# Altium project DC075B.PrjPcb (part 6 of 7)

## Sheet DC075B_DTGC_CPLD.SchDoc: DTGC CPLD
size 558 x 431 mm; Date: Not shown in title block; ApprovedBy: Not shown in title block; CheckedBy: Not shown in title block; Author: Not shown in title block; CompanyName: Not shown in title block; DrawnBy: Praveen Aroul; Engineer: Not shown in title block; Organization: Not shown in title block; Address1: Not shown in title block; Address2: Not shown in title block; Address3: Not shown in title block; Address4: Not shown in title block; DocumentNumber: 9; Revision: Use project parameter SCH_Rev; SheetNumber: 9; SheetTotal: 13; PageSetup: Record=PageOptions|CenterHorizontal=True|CenterVertical=True|PrintScale=1.00|XCorrection=1.00|YCorrection=1.00|PrintKind=0|BorderSize=5000000|LeftOffset=0|BottomOffset=0|Orientation=2|PaperLength=1000|PaperWidth=1000|Scale=100|PaperSource=15|PrintQuality=600|MediaType=1|DitherType=10|PaperKind=Letter|PrintScaleMode=1; CurrentTime: Not shown in title block; CurrentDate: Not shown in title block; Time: Not shown in title block; DocumentFullPathAndName: Not shown in title block; DocumentName: Not shown in title block; ModifiedDate: Not shown in title block; ImagePath: Not shown in title block
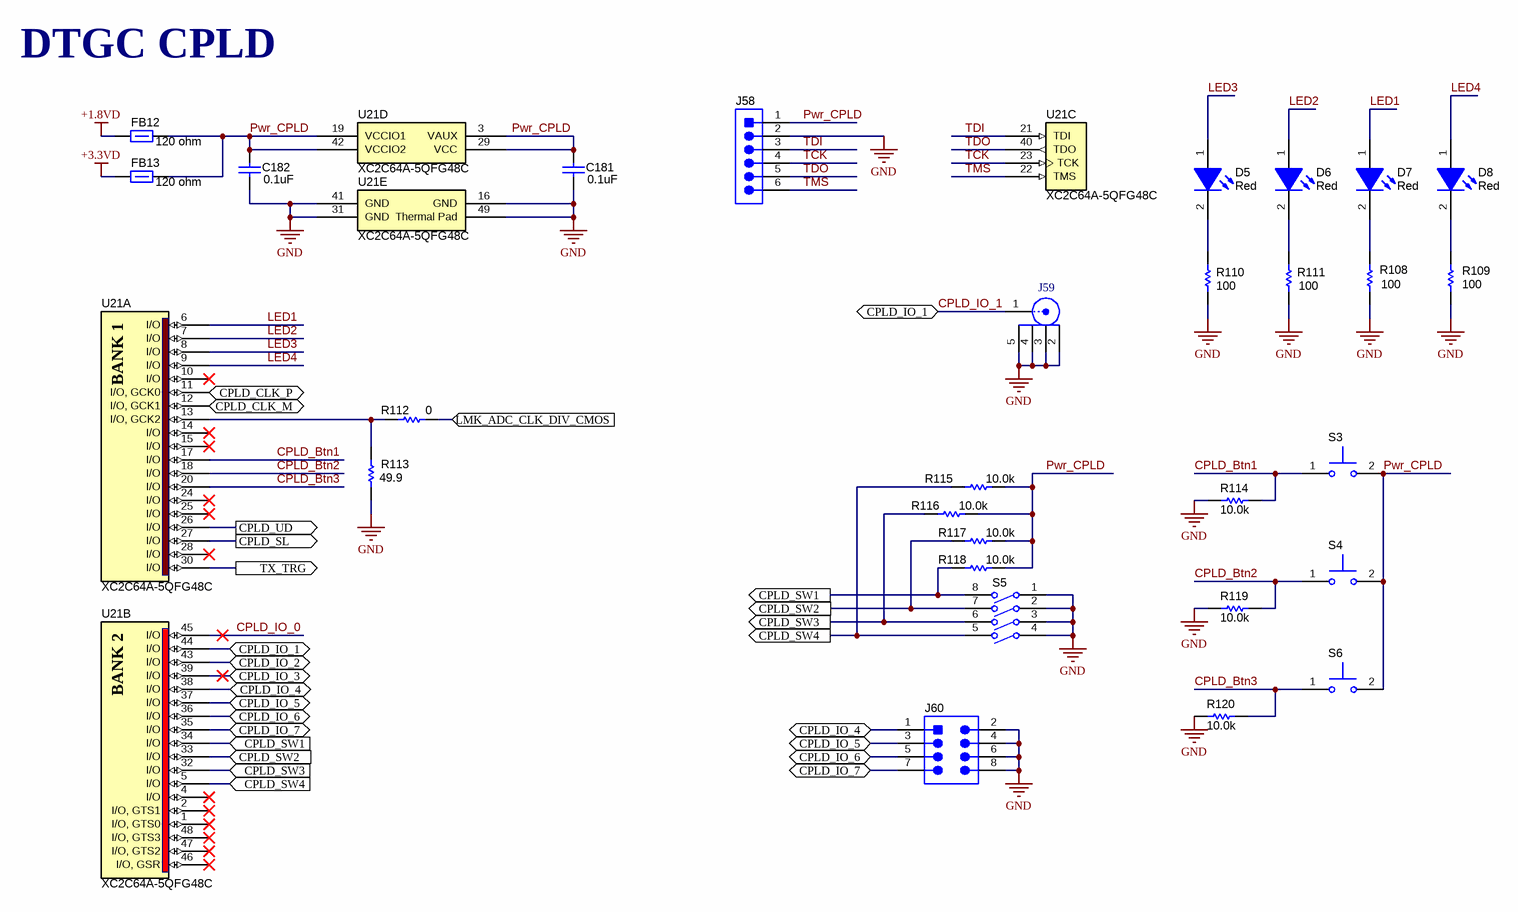
[diagram p24: DC075B_DTGC_CPLD.SchDoc]

### Parts
C181  value 0.1uF  [0603]  (hidden comment: CL10A104KA8NNNC)
C182  value 0.1uF  [0603]  (hidden comment: CL10A104KA8NNNC)
D5  value Red  [LED_LTST-C190_Red]  (hidden comment: LTST-C190CKT)
D6  value Red  [LED_LTST-C190_Red]  (hidden comment: LTST-C190CKT)
D7  value Red  [LED_LTST-C190_Red]  (hidden comment: LTST-C190CKT)
D8  value Red  [LED_LTST-C190_Red]  (hidden comment: LTST-C190CKT)
FB12  value 120 ohm  [0805]  (hidden comment: Ferrite_Bead)
FB13  value 120 ohm  [0805]  (hidden comment: Ferrite_Bead)
J58  Header_6x1  [TSW-106-07-G-S]  (value not drawn)
J59  5-1814832-1  [TE_5-1814832-1]  (value not drawn)
J60  Header_4x2  [TSW-104-07-G-D]  (value not drawn)
R108  ValueDisplayed: 100  [0402]  (hidden comment: Resistor)
R109  ValueDisplayed: 100  [0402]  (hidden comment: Resistor)
R110  ValueDisplayed: 100  [0402]  (hidden comment: Resistor)
R111  ValueDisplayed: 100  [0402]  (hidden comment: Resistor)
R112  value 0  [0402]  (hidden comment: Resistor)
R113  value 49.9  [0402]  (hidden comment: Resistor)
R114  value 10.0k  [0603]  (hidden comment: Resistor)
R115  value 10.0k  [0603]  (hidden comment: Resistor)
R116  value 10.0k  [0603]  (hidden comment: Resistor)
R117  value 10.0k  [0603]  (hidden comment: Resistor)
R118  value 10.0k  [0603]  (hidden comment: Resistor)
R119  value 10.0k  [0603]  (hidden comment: Resistor)
R120  value 10.0k  [0603]  (hidden comment: Resistor)
S3  SKRKAEE020  [SW_SKRKAE]  (value not drawn)
S4  SKRKAEE020  [SW_SKRKAE]  (value not drawn)
S5  SW_4SPST  [SW_1571983-5]  (value not drawn)
S6  SKRKAEE020  [SW_SKRKAE]  (value not drawn)
U21  XC2C64A-5QFG48C  [QFG48_N]  (parts A,B,C,D,E of 5)

### Ports
CPLD_CLK_M (out), CPLD_CLK_P (out), CPLD_IO_1, CPLD_IO_2, CPLD_IO_3, CPLD_IO_4 (bidir), CPLD_IO_5, CPLD_IO_6, CPLD_IO_7, CPLD_SL (out), CPLD_SW1 (in), CPLD_SW1 (out), CPLD_SW2 (in), CPLD_SW2 (out), CPLD_SW3 (in), CPLD_SW3 (out), CPLD_SW4 (in), CPLD_SW4 (out), CPLD_UD (out), LMK_ADC_CLK_DIV_CMOS (in), TX_TRG (out)

### Nets
+1.8VD: FB12.2
+3.3VD: FB13.2
GND: C181.2 C182.2 J58.2 J59.2 J59.3 J59.4 J59.5 J60.2 J60.4 J60.6 J60.8 R108.1 R109.1 R110.1 R111.1 R113.2 R114.2 R119.2 R120.2 S5.1(A1) S5.2(A2) S5.3(A3) S5.4(A4) U21.16(GND) U21.31(GND) U21.41(GND) U21.49(Thermal_Pad)
CPLD_Btn1: R114.1 S3.1 U21.17(I/O)
CPLD_Btn2: R119.1 S4.1 U21.18(I/O)
CPLD_Btn3: R120.1 S6.1 U21.20(I/O)
CPLD_CLK_M: U21.12(I/O,_GCK1) ; port CPLD_CLK_M
CPLD_CLK_P: U21.11(I/O,_GCK0) ; port CPLD_CLK_P
CPLD_IO_0: U21.45(I/O)
CPLD_IO_1: J59.1 U21.44(I/O) ; port CPLD_IO_1
CPLD_IO_2: U21.43(I/O) ; port CPLD_IO_2
CPLD_IO_3: U21.39(I/O) ; port CPLD_IO_3
CPLD_IO_4: J60.1 U21.38(I/O) ; port CPLD_IO_4
CPLD_IO_5: J60.3 U21.37(I/O) ; port CPLD_IO_5
CPLD_IO_6: J60.5 U21.36(I/O) ; port CPLD_IO_6
CPLD_IO_7: J60.7 U21.35(I/O) ; port CPLD_IO_7
CPLD_SL: U21.27(I/O) ; port CPLD_SL
CPLD_SW1: R118.1 S5.8(B1) U21.34(I/O) ; port CPLD_SW1
CPLD_SW2: R117.1 S5.7(B2) U21.33(I/O) ; port CPLD_SW2
CPLD_SW3: R116.1 S5.6(B3) U21.32(I/O) ; port CPLD_SW3
CPLD_SW4: R115.1 S5.5(B4) U21.5(I/O) ; port CPLD_SW4
CPLD_UD: U21.26(I/O) ; port CPLD_UD
LED1: D7.1(A) U21.6(I/O)
LED2: D6.1(A) U21.7(I/O)
LED3: D5.1(A) U21.8(I/O)
LED4: D8.1(A) U21.9(I/O)
LMK_ADC_CLK_DIV_CMOS: R112.1 ; port LMK_ADC_CLK_DIV_CMOS
Pwr_CPLD: C181.1 C182.1 FB12.1 FB13.1 J58.1 R115.2 R116.2 R117.2 R118.2 S3.2 S4.2 S6.2 U21.3(VAUX) U21.19(VCCIO1) U21.29(VCC) U21.42(VCCIO2)
TCK: J58.4 U21.23(TCK)
TDI: J58.3 U21.21(TDI)
TDO: J58.5 U21.40(TDO)
TMS: J58.6 U21.22(TMS)
TX_TRG: U21.30(I/O) ; port TX_TRG
NetD5_2: D5.2(K) R110.2
NetD6_2: D6.2(K) R111.2
NetD7_2: D7.2(K) R108.2
NetD8_2: D8.2(K) R109.2
NetR112_2: R112.2 R113.1 U21.13(I/O,_GCK2)

Not connected (* = marked no-connect by the designer): U21 1(I/O,_GTS0)* 2(I/O,_GTS1)* 4(I/O)* 10(I/O)* 14(I/O)* 15(I/O)* 24(I/O)* 25(I/O)* 28(I/O)* 46(I/O,_GSR)* 47(I/O,_GTS2)* 48(I/O,_GTS3)*

### Notes on the sheet
- DTGC CPLD
- Drawn By:
- SVN Rev:
- Number:
- TID #:
- Orderable:
- Rev:
- Sheet Title:
- File:
- Project Title:
- Designed for:
- Assembly Variant:
- Mod. Date:
- Sheet:
- Size:
- of
- C
- http://www.ti.com
- Texas Instruments and/or its licensors do not warrant the accuracy or completeness of this specification or any information contained therein. Texas Instruments and/or its licensors do not warrant that this design will meet the specifications, will be suitable for your application or fit for any particular purpose, or will operate in an implementation. Texas Instruments and/or its licensors do not warrant that the design is production worthy. You should completely validate and test your design implementation to confirm the system functionality for your application.
- Engineer:
- Contact:
- © Texas Instruments
- (in symbol CMP-0005395-2, part A) BANK 1
- (in symbol CMP-0005395-2, part B) BANK 2

### Library data of the parts
C181 C182 = CMP-0085577-2: CAP, CERM, 0.1 µF, 25 V,+/- 10%, X5R, 0603; Manufacturer: Samsung Electro-Mechanics; Polarized: N; ValueDisplayed: 0.1µF; U/M: EA; Cap_F: 100nF; VDC_V: 25V; TaMin_C: -55°C; TaMax_C: 85°C; AEC Category: Q200; SizeArea_mm2: 1.28; SizeAreaWB_mm2: 4.68; SizeX_mm: 1.6; SizeY_mm: 0.8; SizeZ_mm: 1; Green_REACh: Incomplete; Green_Lifecycle: Active; CompType: Capacitor; PartNumber: CL10A104KA8NNNC; PackageReference: 0603; RoHS: Y; Tolerance_%: 10%; Value2: 25V; MountType: SMT; Technology: Ceramic; TempCo: X5R; Cap_Case: 0603; ComponentLink1Description: Datasheet link; ComponentLink1URL: http://www.samsungsem.com/kr/support/product-search/mlcc/__icsFiles/afieldfile/2018/06/20/CL10A104KA8NNNC.pdf; AEC Grade: N/A; AEC Qualified: N; Green_EU RoHS: Passed; Green_EU RoHS-2: Incomplete
D5-D8 = CMP-0002842-2: LED, Red, SMD; Manufacturer: Lite-On; Vf_V: 2V; Io_A: 20mA; Tjmax_C: 85°C; Power_TotalModule: 62.5mW; Value1: 0.0625W; CompType: LED; MountType: SMT; ComponentLink1URL: http://optoelectronics.liteon.com/en-us/api/DwonloadFileHandler.ashx?txtSpecNo=DS-22-98-0009&txtPartNo=LTST-C190CKT; ComponentLink1Description: Datasheet link; PackageReference: Red LED, 1.6x0.8x0.8mm; PartNumber: LTST-C190CKT; RoHS: Y; Type: ?; Value2: 2V; Color: red
FB12 FB13 = CMP-0003358-1: Ferrite Bead, 120 ohm @ 100 MHz, 0.8 A, 0805; Manufacturer: MuRata; PartNumber: BLM21AG121SN1D; Imax_A: 8dA; DCR_ohm: 1d; Value1: 0.1 ohm; Value2: 0.8A; ZTyp@100MHz_Ohm: 120; SizeArea_mm2: 2.5; SizeAreaWB_mm2: 6.75; SizeX_mm: 2; SizeY_mm: 1.25; SizeZ_mm: 1.45; ComponentLink1Description: Datasheet link; ComponentLink1URL: http://search.murata.co.jp/Ceramy/image/img/PDF/ENG/L0110S0100BLM21A.pdf; CompType: Ferrite Bead; MountType: SMT; PackageReference: 0805; RoHS: Y; Published: 2014-04-30; Publisher: Texas Instruments; LatestRevisionDate: 2017-03-09; Supplier 1: Digi-Key; Supplier Part Number 1: 490-1038-1-ND; Supplier 2: Newark; Supplier Part Number 2: 73M9128; Supplier 3: Mouser; Supplier Part Number 3: 81-BLM21AG121SN1D; ValueDisplayed: 120 ohm
J58 = CMP-0075413-2: Header, 100mil, 6x1, Gold, TH; Manufacturer: Samtec; Cert_CSA: Y; Cert_CULUS: N; Current_A: 6.3A; Gender: Male; Green_Lifecycle: Active; Green_REACh: Passed; Pitch_mm: 2.54; Row_Count: 1; Voltage_V: 550V; PartNumber: TSW-106-07-G-S; PackageReference: 6x1 Header; ClassName: Header; CompType: Header; RoHS: Y; MountType: TH; ComponentLink1Description: Datasheet URL; ComponentLink1URL: http://samtec.com/ftppub/pdf/TSW_TH.PDF; Supplier 1: Digi-Key; Supplier Part Number 1: SAM1029-06-ND; Cert_UL: Y; Cert_VDE: N; Color: Black; ContactFinish: Gold; Green_EU RoHS-2: Passed; Green_EU RoHS: Passed; Orientation: Vertical; PinCount: 6; Shrouded: N
J59 = CMP-0054990-1: SMA Straight PCB Socket Die Cast, 50 Ohm, TH; Manufacturer: TE Connectivity; Green_Lifecycle: Active; Green_REACh: Passed; CNHeader: FALSE; CT: TRUE; PartNumber: 5-1814832-1; PackageReference: SMA Straight PCB Socket Die Cast, TH; CompType: SMA; RoHS: Y; MountType: TH; ComponentLink1Description: Datasheet URL; ComponentLink1URL: http://www.te.com/commerce/DocumentDelivery/DDEController?Action=srchrtrv&DocNm=1814832&DocType=Customer+Drawing&DocLang=English; Supplier 1: Digi-Key; Supplier Part Number 1: A97594-ND; Supplier 2: Newark; Supplier Part Number 2: 78M7270; Supplier 3: Mouser; Supplier Part Number 3: 571-5-1814832-1; Green_EU RoHS-2: Incomplete; Green_EU RoHS: Passed with Exemption; Publisher: Texas Instruments; LatestRevisionDate: 26/05/2017
J60 = CMP-0075408-2: Header, 100mil, 4x2, Gold, TH; Manufacturer: Samtec; Cert_CSA: Y; Cert_CULUS: N; Current_A: 6.3A; Gender: Male; Green_Lifecycle: Active; Green_REACh: Passed; Pitch_mm: 2.54; Row_Count: 2; Voltage_V: 550V; PartNumber: TSW-104-07-G-D; PackageReference: 4x2 Header; ClassName: Header; CompType: Header; RoHS: Y; MountType: TH; ComponentLink1Description: Datasheet URL; ComponentLink1URL: http://samtec.com/ftppub/pdf/TSW_TH.PDF; Supplier 1: Digi-Key; Supplier Part Number 1: SAM1028-04-ND; Cert_UL: Y; Cert_VDE: N; Color: Black; ContactFinish: Gold; Green_EU RoHS-2: Passed; Green_EU RoHS: Passed; Orientation: Vertical; PinCount: 8; RowSpacing_mm: 2.54; Shrouded: N
R108-R111 = CMP-0026656-1: RES, 100, 1%, 0.1 W, 0402; Manufacturer: Panasonic; PartNumber: ERJ-2RKF1000X; Value: 100; Value_Code: 100R; Power_W: 100mW; Value2: 0.1W; VDC_V: 50V; TempCo: 100 ppm/C; EIA_Code: E96; U/M: EA; AEC Category: Q200; SizeArea_mm2: 0.5; SizeX_mm: 1; SizeZ_mm: 0.6; ComponentLink1Description: Datasheet link; ComponentLink1URL: http://industrial.panasonic.com/www-data/pdf/AOA0000/AOA0000CE2.pdf; CompType: Resistor; MountType: SMT; PackageReference: 0402; RoHS: Y; Res_ohm: 100; Tolerance_%: 1%; Value1: 1%; Technology: Thick Film; Published: 2008-06-26; Publisher: Texas Instruments; LatestRevisionDate: 2017-03-09; Supplier 1: Digi-Key; Supplier Part Number 1: P100LCT-ND; Supplier 2: Newark; Supplier Part Number 2: 64R5246; Supplier 3: Mouser; Supplier Part Number 3: 667-ERJ-2RKF1000X; AEC Qualified: ?; SizeY_mm: 0.5
R112 = CMP-0026822-3: RES, 0, 5%, 0.063 W, AEC-Q200 Grade 0, 0402; Manufacturer: Vishay-Dale; PartNumber: CRCW04020000Z0ED; Value_Code: 0000; Power_W: 63mW; Value2: 0.063W; VDC_V: 50V; TempCo: 200 ppm/C; EIA_Code: E24; AEC Category: Q200; AEC Qualified: Y; SizeArea_mm2: 0.5; SizeX_mm: 1; SizeZ_mm: 0.6; ComponentLink1Description: Datasheet link; ComponentLink1URL: http://www.vishay.com/docs/20035/dcrcwe3.pdf; CompType: Resistor; MountType: SMT; PackageReference: 0402; RoHS: E; ValueDisplayed: 0; Res_ohm: 0; Tolerance_%: 5%; Value1: 5%; Technology: Thick Film; Supplier 1: Digi-Key; Supplier Part Number 1: 541-0.0JCT-ND; Supplier 2: Newark; Supplier Part Number 2: 52K6543; Supplier 3: Mouser; Supplier Part Number 3: 71-CRCW0402-0-E3; AEC Grade: 0; SizeY_mm: 0.5
R113 = CMP-0026404-2: RES, 49.9, 1%, 0.063 W, AEC-Q200 Grade 0, 0402; Manufacturer: Vishay-Dale; PartNumber: CRCW040249R9FKED; Value_Code: 49R9; Power_W: 63mW; Value2: 0.063W; VDC_V: 50V; TempCo: 100 ppm/C; EIA_Code: E96; AEC Category: Q200; AEC Grade: 0; AEC Qualified: Y; SizeArea_mm2: 0.5; SizeX_mm: 1; SizeZ_mm: 0.6; ComponentLink1Description: Datasheet link; ComponentLink1URL: http://www.vishay.com/docs/20035/dcrcwe3.pdf; CompType: Resistor; MountType: SMT; PackageReference: 0402; RoHS: E; ValueDisplayed: 49.9; Res_ohm: 49.9; Tolerance_%: 1%; Value1: 1%; Technology: Thick Film; Supplier 1: Digi-Key; Supplier Part Number 1: 541-49.9LCT-ND; Supplier 2: Newark; Supplier Part Number 2: 52K7114; Supplier 3: Mouser; Supplier Part Number 3: 71-CRCW0402-49.9-E3; SizeY_mm: 0.5
R114-R120 = CMP-0022684-3: RES, 10.0 k, 1%, 0.1 W, 0603; Manufacturer: Panasonic; PartNumber: ERJ-3EKF1002V; Res_ohm: 10k; Value_Code: 10k0; Power_W: 100mW; Value2: 0.1W; VDC_V: 75V; TempCo: 100 ppm/C; EIA_Code: E96; U/M: EA; AEC Category: Q200; SizeArea_mm2: 1.28; SizeX_mm: 1.6; SizeY_mm: 0.8; SizeZ_mm: 1; ComponentLink1Description: Datasheet link; ComponentLink1URL: http://industrial.panasonic.com/www-data/pdf/AOA0000/AOA0000CE2.pdf; CompType: Resistor; MountType: SMT; PackageReference: 0603; RoHS: Y; ValueDisplayed: 10.0k; Tolerance_%: 1%; Value1: 1%; Technology: Thick Film; Published: 2008-06-26; Publisher: Texas Instruments; LatestRevisionDate: 2017-03-09; Supplier 1: Digi-Key; Supplier Part Number 1: P10.0KHCT-ND; Supplier 2: Newark; Supplier Part Number 2: 64R5309; Supplier 3: Mouser; Supplier Part Number 3: 667-ERJ-3EKF1002V; AEC Qualified: ?
S3 S4 S6 = CMP-0085606-1: Switch, SPST-NO, 0.05 A, 12 VDC, SMT; Manufacturer: Alps; VDC_V: 12V; PositionCount: 1; CurrentRating_mA: 50A; SizeArea_mm2: 13.92; SizeAreaWB_mm2: 22.62; SizeX_mm: 4.8; SizeY_mm: 2.9; SizeZ_mm: 2.2; PartNumber: SKRKAEE020; MountType: SMT; ComponentLink1Description: Datasheet URL; ComponentLink1URL: https://www.alps.com/prod/info/E/HTML/Tact/SurfaceMount/SKRK/SKRKAEE020.html; RoHS: Y; Circuit: SPST-NO; Orientation: Top Actuated; CompType: Switch; PackageReference: 3.9x2.9mm; Publisher: Texas Instruments; LatestRevisionDate: 2018-11-05
S5 = CMP-0002184-2: Switch, SPST, 4 Pos, Top Actuated, SMD; PartNumber: 1571983-5; Manufacturer: TE Connectivity; VDC_V: 24V; PositionCount: 4; CurrentRating_mA: 25A; MountType: SMT; ComponentLink1Description: Datasheet URL; ComponentLink1URL: http://www.te.com/commerce/DocumentDelivery/DDEController?Action=srchrtrv&DocNm=1571983&DocType=Customer+Drawing&DocLang=English; RoHS: Y; CompType: Switch; PackageReference: SMD, 8-Leads, Pitch 1.27mm; Circuit: SPST; Orientation: Top Actuated; Publisher: Texas Instruments; LatestRevisionDate: 2017-03-09; Supplier 1: Digi-Key; Supplier Part Number 1: 450-1762-1-ND; Supplier 2: Newark; Supplier Part Number 2: 74T0481; Supplier 3: Mouser; Supplier Part Number 3: 506-GDH04STR04
U21 = CMP-0005395-2: XC2C64A CoolRunner-II CPLD, QFG48; Manufacturer: Xilinx; PartNumber: XC2C64A-5QFG48C; MountType: SMT; ComponentLink1Description: Datasheet URL; ComponentLink1URL: http://www.xilinx.com/support/documentation/data_sheets/ds311.pdf; RoHS: Y; PackageReference: QFN-48; Publisher: Texas Instruments; LatestRevisionDate: 09/03/2017; Supplier 1: Digi-Key; Supplier Part Number 1: 122-1419-ND

## Sheet DC075B_LVDS_OUTPUT.SchDoc: LVDS OUTPUT
size 558 x 431 mm; DrawnBy: Praveen Aroul; DocumentNumber: 10; SheetNumber: 10; SheetTotal: 13; PageSetup: Record=PageOptions|CenterHorizontal=True|CenterVertical=True|PrintScale=1.00|XCorrection=1.00|YCorrection=1.00|PrintKind=0|BorderSize=5000000|LeftOffset=0|BottomOffset=0|Orientation=2|PaperLength=1000|PaperWidth=1000|Scale=100|PaperSource=15|PrintQuality=600|MediaType=1|DitherType=10|PaperKind=Letter|PrintScaleMode=1
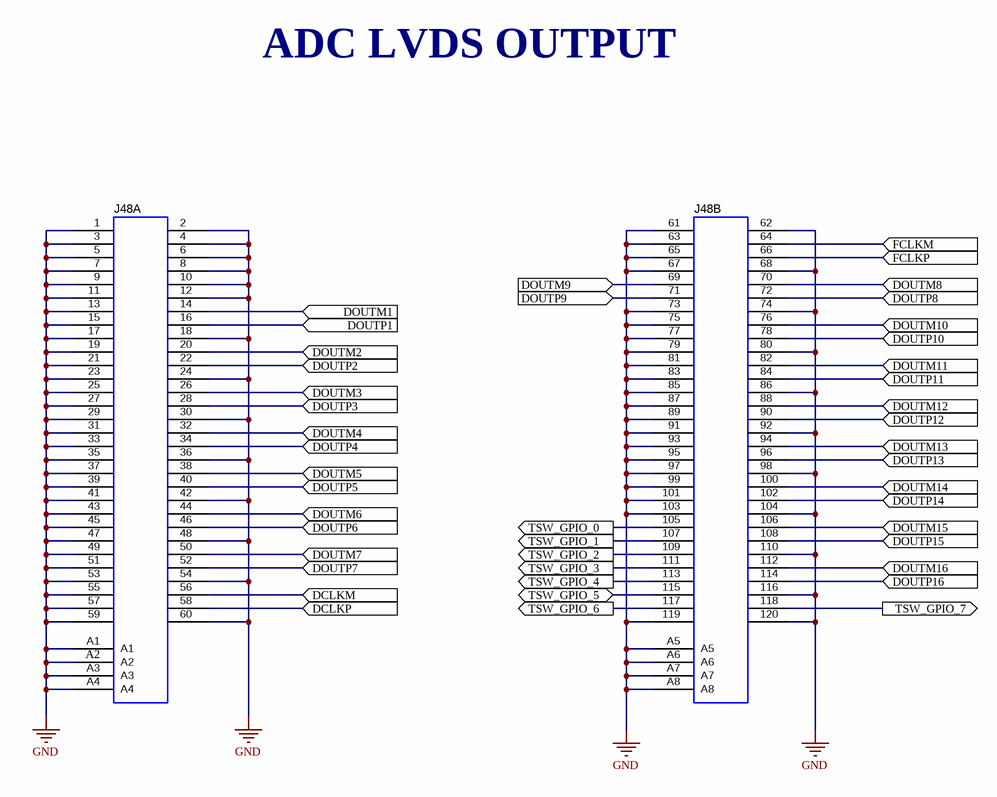
[diagram p25: DC075B_LVDS_OUTPUT.SchDoc]

### Parts
J48  SAMTEC_QTH-060-01-L-D-A  [SAMTEC_QTH-060-01-L-D-A]  (value not drawn)  (parts A,B of 2)

### Ports
DCLKM (in), DCLKP (in), DOUTM1 (in), DOUTM2 (in), DOUTM3 (in), DOUTM4 (in), DOUTM5 (in), DOUTM6 (in), DOUTM7 (in), DOUTM8 (in), DOUTM9 (in), DOUTM10 (in), DOUTM11 (in), DOUTM12 (in), DOUTM13 (in), DOUTM14 (in), DOUTM15 (in), DOUTM16 (in), DOUTP1 (in), DOUTP2 (in), DOUTP3 (in), DOUTP4 (in), DOUTP5 (in), DOUTP6 (in), DOUTP7 (in), DOUTP8 (in), DOUTP9 (in), DOUTP10 (in), DOUTP11 (in), DOUTP12 (in), DOUTP13 (in), DOUTP14 (in), DOUTP15 (in), DOUTP16 (in), FCLKM (in), FCLKP (in), TSW_GPIO_0 (out), TSW_GPIO_1 (out), TSW_GPIO_2 (out), TSW_GPIO_3 (out), TSW_GPIO_4 (out), TSW_GPIO_5, TSW_GPIO_6 (out), TSW_GPIO_7 (out)

### Nets
GND: J48.1 J48.2 J48.3 J48.4 J48.5 J48.6 J48.7 J48.8 J48.9 J48.10 J48.11 J48.12 J48.13 J48.15 J48.17 J48.18 J48.19 J48.21 J48.23 J48.24 J48.25 J48.27 J48.29 J48.30 J48.31 J48.33 J48.35 J48.36 J48.37 J48.39 J48.41 J48.42 J48.43 J48.45 J48.47 J48.48 J48.49 J48.51 J48.53 J48.54 J48.55 J48.57 J48.59 J48.60 J48.61 J48.62 J48.63 J48.65 J48.67 J48.68 J48.73 J48.74 J48.75 J48.77 J48.79 J48.80 J48.81 J48.83 J48.85 J48.86 J48.87 J48.89 J48.91 J48.92 J48.93 J48.95 J48.97 J48.98 J48.99 J48.101 J48.103 J48.104 J48.110 J48.116 J48.119 J48.120 J48.A1 J48.A2 J48.A3 J48.A4 J48.A5 J48.A6 J48.A7 J48.A8
DCLKM: J48.56 ; port DCLKM
DCLKP: J48.58 ; port DCLKP
DOUTM1: J48.14 ; port DOUTM1
DOUTM2: J48.20 ; port DOUTM2
DOUTM3: J48.26 ; port DOUTM3
DOUTM4: J48.32 ; port DOUTM4
DOUTM5: J48.38 ; port DOUTM5
DOUTM6: J48.44 ; port DOUTM6
DOUTM7: J48.50 ; port DOUTM7
DOUTM8: J48.70 ; port DOUTM8
DOUTM9: J48.69 ; port DOUTM9
DOUTM10: J48.76 ; port DOUTM10
DOUTM11: J48.82 ; port DOUTM11
DOUTM12: J48.88 ; port DOUTM12
DOUTM13: J48.94 ; port DOUTM13
DOUTM14: J48.100 ; port DOUTM14
DOUTM15: J48.106 ; port DOUTM15
DOUTM16: J48.112 ; port DOUTM16
DOUTP1: J48.16 ; port DOUTP1
DOUTP2: J48.22 ; port DOUTP2
DOUTP3: J48.28 ; port DOUTP3
DOUTP4: J48.34 ; port DOUTP4
DOUTP5: J48.40 ; port DOUTP5
DOUTP6: J48.46 ; port DOUTP6
DOUTP7: J48.52 ; port DOUTP7
DOUTP8: J48.72 ; port DOUTP8
DOUTP9: J48.71 ; port DOUTP9
DOUTP10: J48.78 ; port DOUTP10
DOUTP11: J48.84 ; port DOUTP11
DOUTP12: J48.90 ; port DOUTP12
DOUTP13: J48.96 ; port DOUTP13
DOUTP14: J48.102 ; port DOUTP14
DOUTP15: J48.108 ; port DOUTP15
DOUTP16: J48.114 ; port DOUTP16
FCLKM: J48.64 ; port FCLKM
FCLKP: J48.66 ; port FCLKP
TSW_GPIO_0: J48.105 ; port TSW_GPIO_0
TSW_GPIO_1: J48.107 ; port TSW_GPIO_1
TSW_GPIO_2: J48.109 ; port TSW_GPIO_2
TSW_GPIO_3: J48.111 ; port TSW_GPIO_3
TSW_GPIO_4: J48.113 ; port TSW_GPIO_4
TSW_GPIO_5: J48.115 ; port TSW_GPIO_5
TSW_GPIO_6: J48.117 ; port TSW_GPIO_6
TSW_GPIO_7: J48.118 ; port TSW_GPIO_7

### Notes on the sheet
- ADC LVDS OUTPUT
- Drawn By:
- SVN Rev:
- Number:
- TID #:
- Orderable:
- Rev:
- Sheet Title:
- File:
- Project Title:
- Designed for:
- Assembly Variant:
- Mod. Date:
- Sheet:
- Size:
- of
- C
- http://www.ti.com
- Texas Instruments and/or its licensors do not warrant the accuracy or completeness of this specification or any information contained therein. Texas Instruments and/or its licensors do not warrant that this design will meet the specifications, will be suitable for your application or fit for any particular purpose, or will operate in an implementation. Texas Instruments and/or its licensors do not warrant that the design is production worthy. You should completely validate and test your design implementation to confirm the system functionality for your application.
- Engineer:
- Contact:
- © Texas Instruments

### Library data of the parts
J48 = CMP-0056023-2: Socket, 0.5MM, 60x2, Gold, SMT; Manufacturer: Samtec; Green_Lifecycle: Not Set; Green_REACh: Incomplete; PartNumber: QTH-060-01-L-D-A; PackageReference: Socket, Female, 0.5MM, 60x2, SMT; CompType: Socket; RoHS: Y; MountType: SMT; ComponentLink1Description: Datasheet URL; ComponentLink1URL: http://www.samtec.com/documents/webfiles/cpdf/QTH-XXX-XX-X-D-XXX-MKT.pdf; Supplier 1: Digi-Key; Supplier Part Number 1: SAM8189-ND; Supplier 2: Newark; Supplier Part Number 2: 11P6110; Supplier 3: Farnell; Supplier Part Number 3: 1667909; Green_EU RoHS-2: Incomplete; Green_EU RoHS: Incomplete

## Sheet DC075B_JESD_OUTPUT.SchDoc: JESD OUTPUT
size 558 x 431 mm; DrawnBy: Praveen Aroul; DocumentNumber: 11; SheetNumber: 11; SheetTotal: 13; PageSetup: Record=PageOptions|CenterHorizontal=True|CenterVertical=True|PrintScale=1.00|XCorrection=1.00|YCorrection=1.00|PrintKind=0|BorderSize=5000000|LeftOffset=0|BottomOffset=0|Orientation=2|PaperLength=1000|PaperWidth=1000|Scale=100|PaperSource=15|PrintQuality=600|MediaType=1|DitherType=10|PaperKind=Letter|PrintScaleMode=1
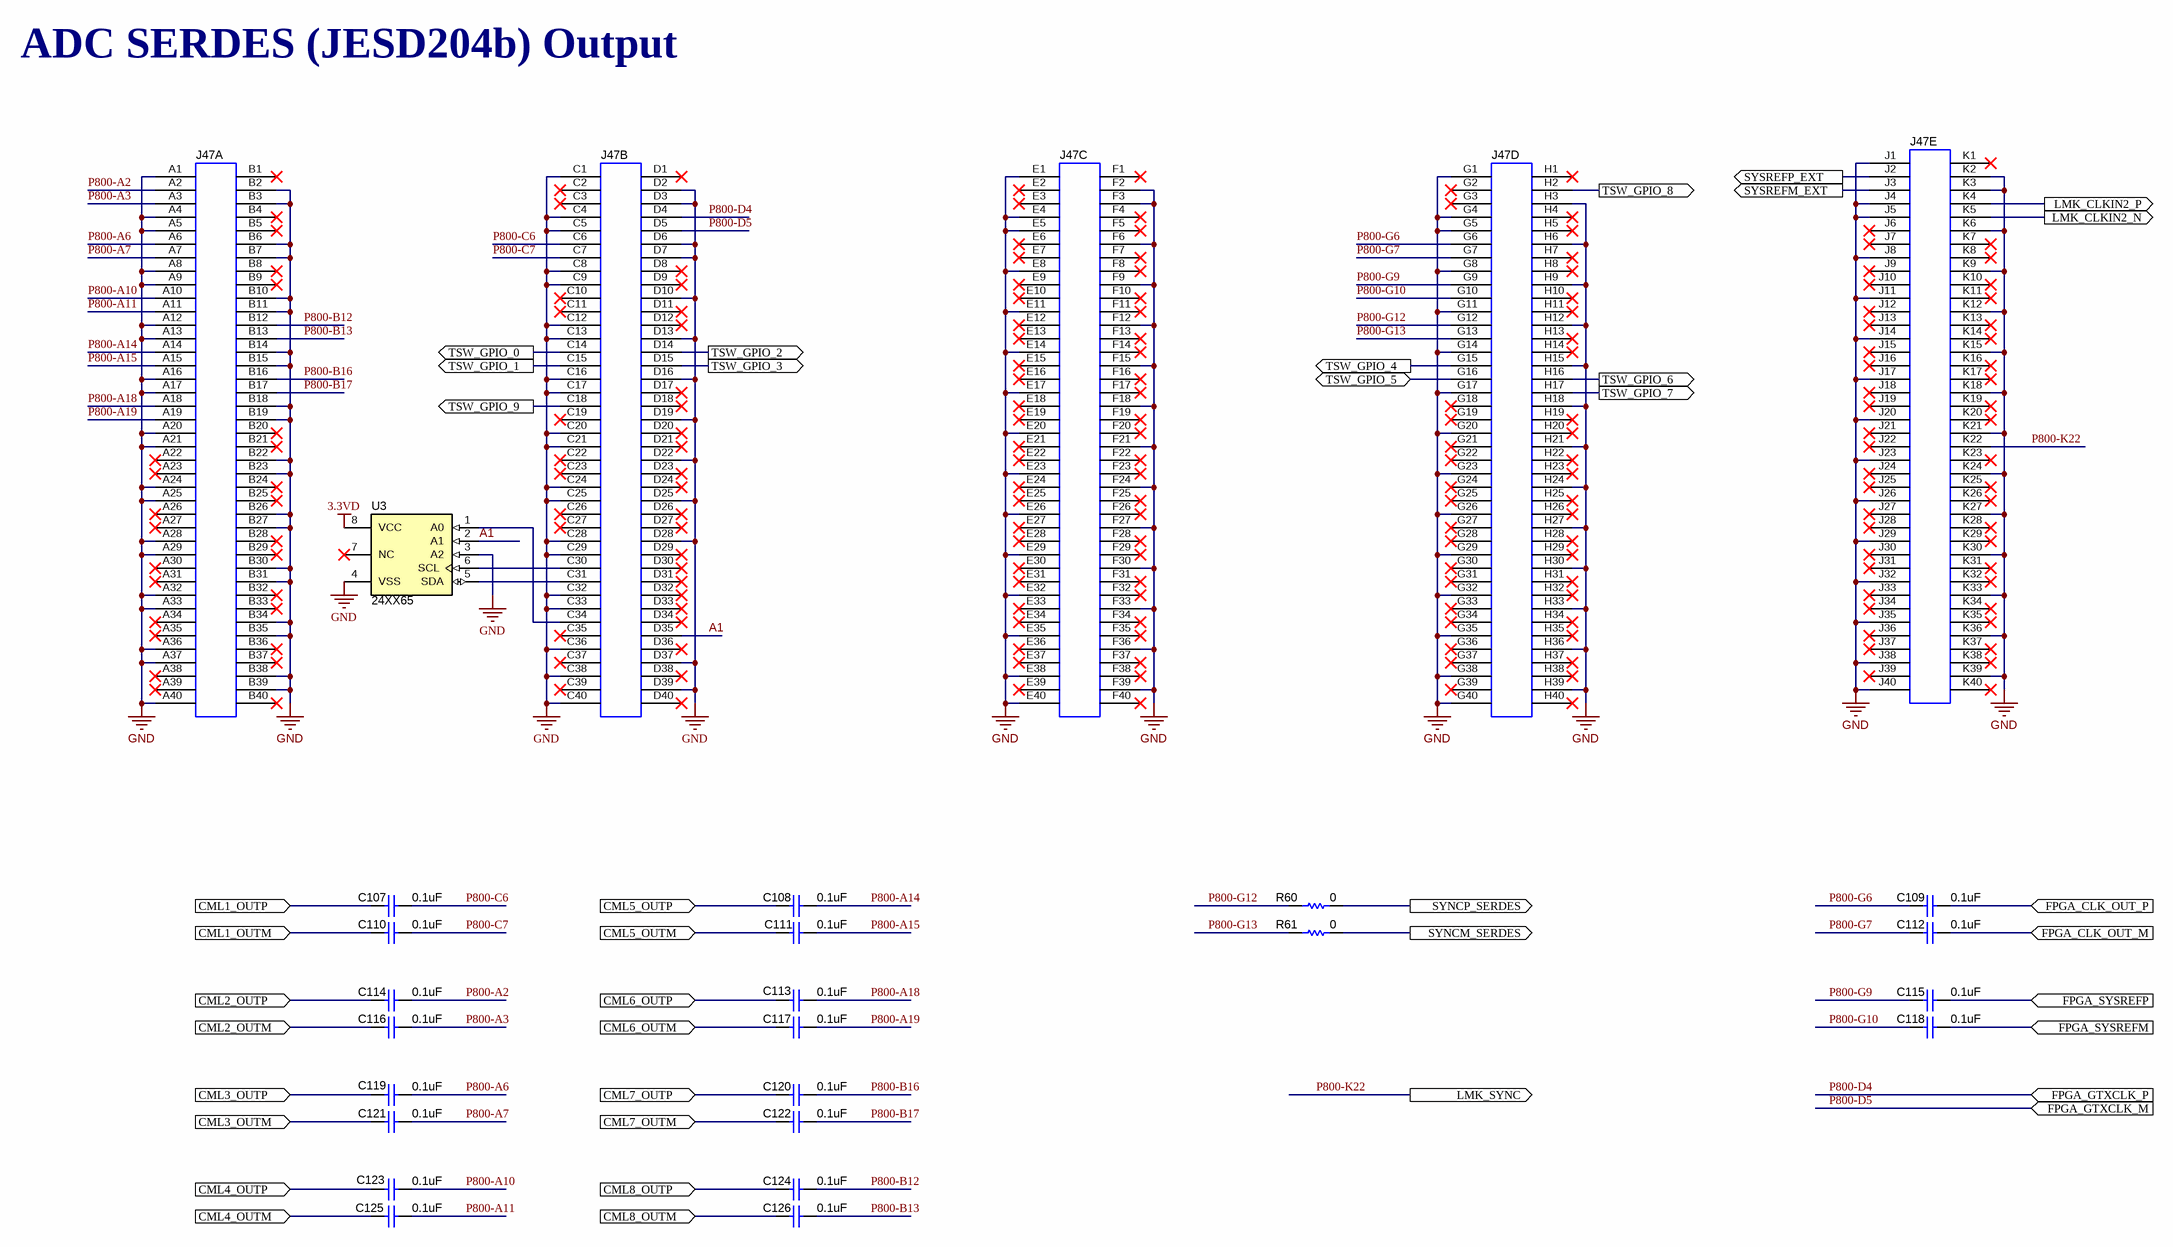
[diagram p26: DC075B_JESD_OUTPUT.SchDoc]

### Parts
C107  value 0.1uF  [0402]  (hidden comment: Capacitor)
C108  value 0.1uF  [0402]  (hidden comment: Capacitor)
C109  value 0.1uF  [0402]  (hidden comment: Capacitor)
C110  value 0.1uF  [0402]  (hidden comment: Capacitor)
C111  value 0.1uF  [0402]  (hidden comment: Capacitor)
C112  value 0.1uF  [0402]  (hidden comment: Capacitor)
C113  value 0.1uF  [0402]  (hidden comment: Capacitor)
C114  value 0.1uF  [0402]  (hidden comment: Capacitor)
C115  value 0.1uF  [0402]  (hidden comment: Capacitor)
C116  value 0.1uF  [0402]  (hidden comment: Capacitor)
C117  value 0.1uF  [0402]  (hidden comment: Capacitor)
C118  value 0.1uF  [0402]  (hidden comment: Capacitor)
C119  value 0.1uF  [0402]  (hidden comment: Capacitor)
C120  value 0.1uF  [0402]  (hidden comment: Capacitor)
C121  value 0.1uF  [0402]  (hidden comment: Capacitor)
C122  value 0.1uF  [0402]  (hidden comment: Capacitor)
C123  value 0.1uF  [0402]  (hidden comment: Capacitor)
C124  value 0.1uF  [0402]  (hidden comment: Capacitor)
C125  value 0.1uF  [0402]  (hidden comment: Capacitor)
C126  value 0.1uF  [0402]  (hidden comment: Capacitor)
J47  SAMTEC_ASP-134602-01  [SAMTEC_ASP-134602-01]  (value not drawn)  (parts A,B,C,D,E of 5)
R60  value 0  [0402]  (hidden comment: Resistor)
R61  value 0  [0402]  (hidden comment: Resistor)
U3  24XX65  [SOIC127P800X216-8N]

### Ports
CML1_OUTM (in), CML1_OUTP (in), CML2_OUTM (in), CML2_OUTP (in), CML3_OUTM (in), CML3_OUTP (in), CML4_OUTM (in), CML4_OUTP (in), CML5_OUTM (in), CML5_OUTP (in), CML6_OUTM (in), CML6_OUTP (in), CML7_OUTM (in), CML7_OUTP (in), CML8_OUTM (in), CML8_OUTP (in), FPGA_CLK_OUT_M (in), FPGA_CLK_OUT_P (in), FPGA_GTXCLK_M (in), FPGA_GTXCLK_P (in), FPGA_SYSREFM (in), FPGA_SYSREFP (in), LMK_CLKIN2_N (out), LMK_CLKIN2_P (out), LMK_SYNC (out), SYNCM_SERDES (out), SYNCP_SERDES (out), SYSREFM_EXT (out), SYSREFP_EXT (out), TSW_GPIO_0 (out), TSW_GPIO_1 (out), TSW_GPIO_2 (out), TSW_GPIO_3 (out), TSW_GPIO_4 (out), TSW_GPIO_5, TSW_GPIO_6 (out), TSW_GPIO_7 (out), TSW_GPIO_8 (out), TSW_GPIO_9 (out)

### Nets
3.3VD: U3.8(VCC)
GND: J47.A1 J47.A4 J47.A5 J47.A8 J47.A9 J47.A12 J47.A13 J47.A16 J47.A17 J47.A20 J47.A21 J47.A24 J47.A25 J47.A28 J47.A29 J47.A32 J47.A33 J47.A36 J47.A37 J47.A40 J47.B2 J47.B3 J47.B6 J47.B7 J47.B10 J47.B11 J47.B14 J47.B15 J47.B18 J47.B19 J47.B22 J47.B23 J47.B26 J47.B27 J47.B30 J47.B31 J47.B34 J47.B35 J47.B38 J47.B39 J47.C1 J47.C4 J47.C5 J47.C8 J47.C9 J47.C12 J47.C13 J47.C16 J47.C17 J47.C20 J47.C21 J47.C24 J47.C25 J47.C28 J47.C29 J47.C32 J47.C33 J47.C36 J47.C38 J47.C40 J47.D2 J47.D3 J47.D6 J47.D7 J47.D10 J47.D13 J47.D16 J47.D19 J47.D22 J47.D25 J47.D28 J47.D37 J47.D39 J47.E1 J47.E4 J47.E5 J47.E8 J47.E11 J47.E14 J47.E17 J47.E20 J47.E23 J47.E26 J47.E29 J47.E32 J47.E35 J47.E38 J47.E40 J47.F2 J47.F3 J47.F6 J47.F9 J47.F12 J47.F15 J47.F18 J47.F21 J47.F24 J47.F27 J47.F30 J47.F33 J47.F36 J47.F39 J47.G1 J47.G4 J47.G5 J47.G8 J47.G11 J47.G14 J47.G17 J47.G20 J47.G23 J47.G26 J47.G29 J47.G32 J47.G35 J47.G38 J47.G40 J47.H3 J47.H6 J47.H9 J47.H12 J47.H15 J47.H18 J47.H21 J47.H24 J47.H27 J47.H30 J47.H33 J47.H36 J47.H39 J47.J1 J47.J4 J47.J5 J47.J8 J47.J11 J47.J14 J47.J17 J47.J20 J47.J23 J47.J26 J47.J29 J47.J32 J47.J35 J47.J38 J47.J40 J47.K2 J47.K3 J47.K6 J47.K9 J47.K12 J47.K15 J47.K18 J47.K21 J47.K24 J47.K27 J47.K30 J47.K33 J47.K36 J47.K39 U3.3(A2) U3.4(VSS)
A1: J47.D35 U3.2(A1)
CML1_OUTM: C110.2 ; port CML1_OUTM
CML1_OUTP: C107.2 ; port CML1_OUTP
CML2_OUTM: C116.2 ; port CML2_OUTM
CML2_OUTP: C114.2 ; port CML2_OUTP
CML3_OUTM: C121.2 ; port CML3_OUTM
CML3_OUTP: C119.2 ; port CML3_OUTP
CML4_OUTM: C125.2 ; port CML4_OUTM
CML4_OUTP: C123.2 ; port CML4_OUTP
CML5_OUTM: C111.2 ; port CML5_OUTM
CML5_OUTP: C108.2 ; port CML5_OUTP
CML6_OUTM: C117.2 ; port CML6_OUTM
CML6_OUTP: C113.2 ; port CML6_OUTP
CML7_OUTM: C122.2 ; port CML7_OUTM
CML7_OUTP: C120.2 ; port CML7_OUTP
CML8_OUTM: C126.2 ; port CML8_OUTM
CML8_OUTP: C124.2 ; port CML8_OUTP
FPGA_CLK_OUT_M: C112.1 ; port FPGA_CLK_OUT_M
FPGA_CLK_OUT_P: C109.1 ; port FPGA_CLK_OUT_P
FPGA_SYSREFM: C118.1 ; port FPGA_SYSREFM
FPGA_SYSREFP: C115.1 ; port FPGA_SYSREFP
LMK_CLKIN2_N: J47.K5 ; port LMK_CLKIN2_N
LMK_CLKIN2_P: J47.K4 ; port LMK_CLKIN2_P
P800-A2: C114.1 J47.A2
P800-A3: C116.1 J47.A3
P800-A6: C119.1 J47.A6
P800-A7: C121.1 J47.A7
P800-A10: C123.1 J47.A10
P800-A11: C125.1 J47.A11
P800-A14: C108.1 J47.A14
P800-A15: C111.1 J47.A15
P800-A18: C113.1 J47.A18
P800-A19: C117.1 J47.A19
P800-B12: C124.1 J47.B12
P800-B13: C126.1 J47.B13
P800-B16: C120.1 J47.B16
P800-B17: C122.1 J47.B17
P800-C6: C107.1 J47.C6
P800-C7: C110.1 J47.C7
P800-D4: J47.D4 ; port FPGA_GTXCLK_P  [project net FPGA_GTXCLK_P]
P800-D5: J47.D5 ; port FPGA_GTXCLK_M  [project net FPGA_GTXCLK_M]
P800-G6: C109.2 J47.G6
P800-G7: C112.2 J47.G7
P800-G9: C115.2 J47.G9
P800-G10: C118.2 J47.G10
P800-G12: J47.G12 R60.1
P800-G13: J47.G13 R61.1
P800-K22: J47.K22 ; port LMK_SYNC  [project net LMK_SYNC]
SYNCM_SERDES: R61.2 ; port SYNCM_SERDES
SYNCP_SERDES: R60.2 ; port SYNCP_SERDES
SYSREFM_EXT: J47.J3 ; port SYSREFM_EXT
SYSREFP_EXT: J47.J2 ; port SYSREFP_EXT
TSW_GPIO_0: J47.C14 ; port TSW_GPIO_0
TSW_GPIO_1: J47.C15 ; port TSW_GPIO_1
TSW_GPIO_2: J47.D14 ; port TSW_GPIO_2
TSW_GPIO_3: J47.D15 ; port TSW_GPIO_3
TSW_GPIO_4: J47.G15 ; port TSW_GPIO_4
TSW_GPIO_5: J47.G16 ; port TSW_GPIO_5
TSW_GPIO_6: J47.H16 ; port TSW_GPIO_6
TSW_GPIO_7: J47.H17 ; port TSW_GPIO_7
TSW_GPIO_8: J47.H2 ; port TSW_GPIO_8
TSW_GPIO_9: J47.C18 ; port TSW_GPIO_9
NetJ47_C30: J47.C30 U3.6(SCL)
NetJ47_C31: J47.C31 U3.5(SDA)
NetJ47_C34: J47.C34 U3.1(A0)

Not connected (* = marked no-connect by the designer): J47 A22* A23* A26* A27* A30* A31* A34* A35* A38* A39* B1* B4* B5* B8* B9* B20* B21* B24* B25* B28* B29* B32* B33* B36* B37* B40* C2* C3* C10* C11* C19* C22* C23* C26* C27* C35* C37* C39* D1* D8* D9* D11* D12* D17* D18* D20* D21* D23* D24* D26* D27* D29* D30* D31* D32* D33* D34* D36* D38* D40* E2* E3* E6* E7* E9* E10* E12* E13* E15* E16* E18* E19* E21* E22* E24* E25* E27* E28* E30* E31* E33* E34* E36* E37* E39* F1* F4* F5* F7* F8* F10* F11* F13* F14* F16* F17* F19* F20* F22* F23* F25* F26* F28* F29* F31* F32* F34* F35* F37* F38* F40* G2* G3* G18* G19* G21* G22* G24* G25* G27* G28* G30* G31* G33* G34* G36* G37* G39* H1* H4* H5* H7* H8* H10* H11* H13* H14* H19* H20* H22* H23* H25* H26* H28* H29* H31* H32* H34* H35* H37* H38* H40* J6* J7* J9* J10* J12* J13* J15* J16* J18* J19* J21* J22* J24* J25* J27* J28* J30* J31* J33* J34* J36* J37* J39* K1* K7* K8* K10* K11* K13* K14* K16* K17* K19* K20* K23* K25* K26* K28* K29* K31* K32* K34* K35* K37* K38* K40*; U3 7(NC)*

### Notes on the sheet
- ADC SERDES (JESD204b) Output
- Drawn By:
- SVN Rev:
- Number:
- TID #:
- Orderable:
- Rev:
- Sheet Title:
- File:
- Project Title:
- Designed for:
- Assembly Variant:
- Mod. Date:
- Sheet:
- Size:
- of
- C
- http://www.ti.com
- Texas Instruments and/or its licensors do not warrant the accuracy or completeness of this specification or any information contained therein. Texas Instruments and/or its licensors do not warrant that this design will meet the specifications, will be suitable for your application or fit for any particular purpose, or will operate in an implementation. Texas Instruments and/or its licensors do not warrant that the design is production worthy. You should completely validate and test your design implementation to confirm the system functionality for your application.
- Engineer:
- Contact:
- © Texas Instruments

### Library data of the parts
C107-C126 = CMP-0006641-2: CAP, CERM, 0.1 uF, 16 V, +/- 10%, X7R, 0402; PartNumber: GRM155R71C104KA88D; Manufacturer: MuRata; Polarized: N; U/M: EA; Cap_F: 100nF; Value1: Unknown; VDC_V: 16V; TaMin_C: -55°C; TaMax_C: 125°C; AEC Category: Q200; SizeArea_mm2: 0.5; SizeAreaWB_mm2: 3; SizeX_mm: 1; SizeZ_mm: 0.6; CompType: Capacitor; ValueDisplayed: 0.1uF; PackageReference: 0402; RoHS: Y; Tolerance_%: 10%; Value2: 16V; MountType: SMT; Technology: Ceramic; TempCo: X7R; Cap_Case: 0402; Published: 2008-06-19; Publisher: Texas Instruments; LatestRevisionDate: 2017-03-09; ComponentLink1Description: Datasheet link; ComponentLink1URL: http://search.murata.co.jp/Ceramy/PnsearchViewAction.do?HnOFG=ON&HnNFG=ON&SEL_CNT=50&sLang=en&sKey=GRM155R71C104KA88D&x=9&y=9&search=startwith; Supplier 1: Digi-Key; Supplier Part Number 1: 490-3261-1-ND; Supplier 2: Newark; Supplier Part Number 2: 38K1647; Supplier 3: Mouser; Supplier Part Number 3: 81-GRM155R71C104KA88; AEC Qualified: ?; SizeY_mm: 0.5
J47 = CMP-0056027-1: Connector, Male, 1.27 mm, 40x4, SMD; Manufacturer: Samtec; CNHeader: FALSE; PartNumber: ASP-134602-01; PackageReference: Connector, Male, 1.27 mm, 40x4, SMD; CompType: Connector; RoHS: Y; MountType: SMT; ComponentLink1Description: Datasheet URL; ComponentLink1URL: http://www.samtec.com/documents/webfiles/Cpdf/ASP-134602-01-mkt.pdf; Publisher: Texas Instruments; LatestRevisionDate: 26/05/2017; Supplier 1: Digi-Key; Supplier Part Number 1: SAM8731-ND; Supplier 2: Farnell; Supplier Part Number 2: 2433505; CT: FALSE
R60 R61 = CMP-0026822-3: as R112 on sheet DC075B_DTGC_CPLD; ComponentLink1Description: Datasheet link; ComponentLink1URL: http://www.vishay.com/docs/20035/dcrcwe3.pdf; CompType: Resistor; MountType: SMT; PackageReference: 0402; RoHS: E; ValueDisplayed: 0; Res_ohm: 0; Tolerance_%: 5%; Value1: 5%; Technology: Thick Film; Supplier 1: Digi-Key; Supplier Part Number 1: 541-0.0JCT-ND; Supplier 2: Newark; Supplier Part Number 2: 52K6543; Supplier 3: Mouser; Supplier Part Number 3: 71-CRCW0402-0-E3; AEC Grade: 0; SizeY_mm: 0.5
U3 = CMP-0005258-2: 64K I2C Smart Serial EEPROM, SOIC-8; PartNumber: 24LC65-I/SM; Manufacturer: Microchip; MountType: SMT; ComponentLink1Description: Datasheet URL; ComponentLink1URL: http://ww1.microchip.com/downloads/en/DeviceDoc/21073K.pdf; RoHS: Y; PackageReference: SOIC-8, 208mil wide; Publisher: Texas Instruments; LatestRevisionDate: 09/03/2017; Supplier 1: Digi-Key; Supplier Part Number 1: 24LC65-I/SM-ND; Supplier 2: Newark; Supplier Part Number 2: 89C9816; Supplier 3: Mouser; Supplier Part Number 3: 579-24LC65-I/SM